# Altium schematic sheet 插式微步進驅動器.SCHDOC
size A4
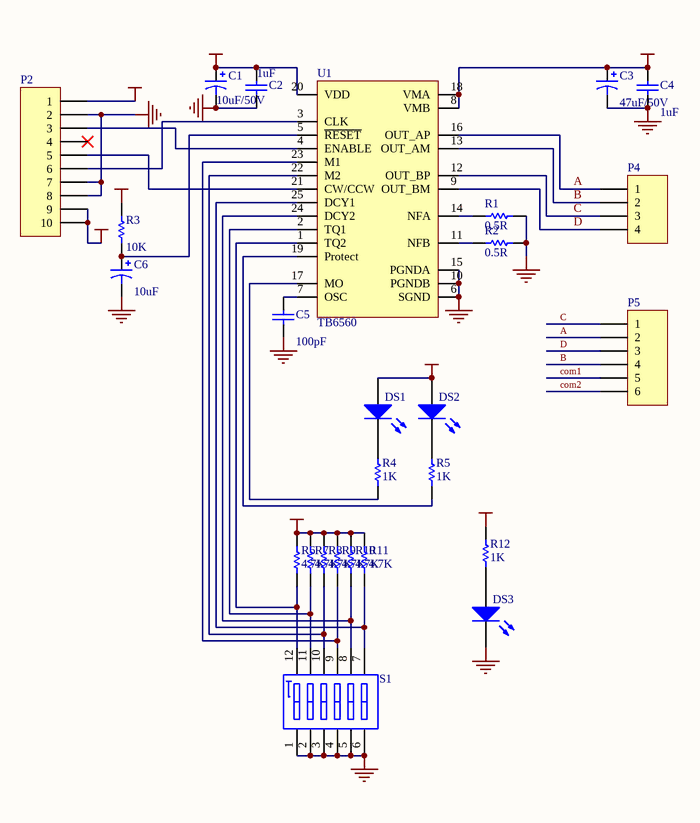
[diagram p0: 插式微步進驅動器.SCHDOC]

## Parts
C1  value 10uF/50V  [CAPPR5-5x5]  (hidden comment: Cap Pol1)
C2  value 1uF  [CAPR5.08-7.8x3.2]  (hidden comment: Cap)
C3  value 47uF/50V  [CAPPR5-5x5]  (hidden comment: Cap Pol1)
C4  value 1uF  [CAPR5.08-7.8x3.2]  (hidden comment: Cap)
C5  value 100pF  [CAPR5.08-7.8x3.2]  (hidden comment: Cap)
C6  value 10uF  [CAPPR5-5x5]  (hidden comment: Cap Pol1)
DS1  LED1  [LED 3mm T]  (value not drawn)
DS2  LED1  [LED 3mm T]  (value not drawn)
DS3  LED1  [LED 3mm T]  (value not drawn)
P2  Header 10  [HDR1X10]  (value not drawn)
P4  Header 4  [4pin夾式端子台]  (value not drawn)
P5  Header 6  [HDR1X6]  (value not drawn)
R1  value 0.5R  [¹qªý5.08mm]  (hidden comment: Res1)
R2  value 0.5R  [¹qªý5.08mm]  (hidden comment: Res1)
R3  value 10K  [AXIAL-0.3]  (hidden comment: Res1)
R4  value 1K  [AXIAL-0.3]  (hidden comment: Res1)
R5  value 1K  [AXIAL-0.3]  (hidden comment: Res1)
R6  value 4.7K  [AXIAL-0.3]  (hidden comment: Res1)
R7  value 4.7K  [AXIAL-0.3]  (hidden comment: Res1)
R8  value 4.7K  [AXIAL-0.3]  (hidden comment: Res1)
R9  value 4.7K  [AXIAL-0.3]  (hidden comment: Res1)
R10  value 4.7K  [AXIAL-0.3]  (hidden comment: Res1)
R11  value 4.7K  [AXIAL-0.3]  (hidden comment: Res1)
R12  value 1K  [AXIAL-0.3]  (hidden comment: Res1)
S1  SW DIP-6  [DIP-12/SW]  (value not drawn)
U1  TB6560  [TB6560AHQ]

## Nets
+12: C3.1 C4.2 P2.9 P2.10 U1.8(VMB) U1.18(VMA)
GND: C1.2 C2.1 C3.2 C4.1 C5.1 C6.2 DS3.2(K) P2.2 P2.7 P2.8 R1.2 R2.2 S1.1(A1) S1.2(A2) S1.3(A3) S1.4(A4) S1.5(A5) S1.6(A6) U1.6(SGND) U1.10(PGNDB) U1.15(PGNDA)
VCC: C1.1 C2.2 DS1.1(A) DS2.1(A) P2.1 R3.2 R6.2 R7.2 R8.2 R9.2 R10.2 R11.2 R12.2 U1.20(VDD)
A: P4.1 P5.2 U1.16(OUT_AP)
B: P4.2 P5.4 U1.13(OUT_AM)
C: P4.3 P5.1 U1.12(OUT_BP)
com1: P5.5
com2: P5.6
D: P4.4 P5.3 U1.9(OUT_BM)
NetC5_2: C5.2 U1.7(OSC)
NetC6_1: C6.1 R3.1 U1.5(~{RESET})
NetDS1_2: DS1.2(K) R4.2
NetDS2_2: DS2.2(K) R5.2
NetDS3_1: DS3.1(A) R12.1
NetP2_3: P2.3 U1.4(ENABLE)
NetP2_5: P2.5 U1.21(CW/CCW)
NetP2_6: P2.6 U1.3(CLK)
NetR1_1: R1.1 U1.14(NFA)
NetR2_1: R2.1 U1.11(NFB)
NetR4_1: R4.1 U1.17(MO)
NetR5_1: R5.1 U1.19(Protect)
NetR6_1: R6.1 S1.12(B1) U1.1(TQ2)
NetR7_1: R7.1 S1.11(B2) U1.2(TQ1)
NetR8_1: R8.1 S1.10(B3) U1.22(M2)
NetR9_1: R9.1 S1.9(B4) U1.23(M1)
NetR10_1: R10.1 S1.8(B5) U1.24(DCY2)
NetR11_1: R11.1 S1.7(B6) U1.25(DCY1)

Not connected (* = marked no-connect by the designer): P2 4*

## Library data of the parts
C1 C3 C6 = Cap Pol1: Polarized Capacitor (Radial); Published: 8-Jun-2000; LatestRevisionDate: 17-Jul-2002; LatestRevisionNote: Re-released for DXP Platform.; Publisher: Altium Limited
C2 C4 C5 = Cap: Capacitor; Published: 8-Jun-2000; LatestRevisionDate: 17-Jul-2002; LatestRevisionNote: Re-released for DXP Platform.; Publisher: Altium Limited
DS1-DS3 = LED1: Typical RED GaAs LED; Published: 8-Jun-2000; LatestRevisionDate: 17-Jul-2002; LatestRevisionNote: Re-released for DXP Platform.; Publisher: Altium Limited
P2 = Header 10: Header, 10-Pin; LatestRevisionDate: 17-Jul-2002; LatestRevisionNote: Re-released for DXP Platform.; Publisher: Altium Limited
P4 = Header 4: Header, 4-Pin; LatestRevisionDate: 17-Jul-2002; LatestRevisionNote: Re-released for DXP Platform.; Publisher: Altium Limited
P5 = Header 6: Header, 6-Pin; LatestRevisionDate: 17-Jul-2002; LatestRevisionNote: Re-released for DXP Platform.; Publisher: Altium Limited
R1-R12 = Res1: Resistor; Published: 8-Jun-2000; LatestRevisionDate: 17-Jul-2002; LatestRevisionNote: Re-released for DXP Platform.; Publisher: Altium Limited
S1 = SW DIP-6: DIP Switch; Published: 24-Mar-1999; LatestRevisionDate: 17-Jul-2002; LatestRevisionNote: Re-released for DXP Platform.; Publisher: Altium Limited